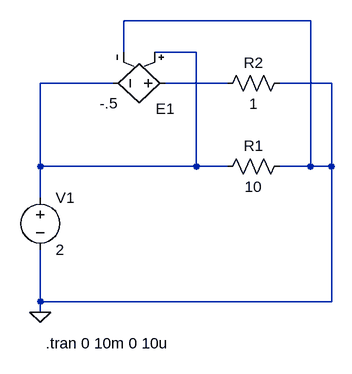
[diagram p0: schematic vcvs_2.asc]
vcvs_2.asc, the LTspice schematic file:
Version 4.1
SHEET 1 880 680
WIRE 368 -96 80 -96
WIRE 80 -48 80 -96
WIRE 192 -48 128 -48
WIRE 64 0 -48 0
WIRE 240 0 144 0
WIRE 400 0 320 0
WIRE -48 128 -48 0
WIRE 192 128 192 -48
WIRE 192 128 -48 128
WIRE 240 128 192 128
WIRE 368 128 368 -96
WIRE 368 128 320 128
WIRE 400 128 400 0
WIRE 400 128 368 128
WIRE -48 176 -48 128
WIRE -48 336 -48 256
WIRE 400 336 400 128
WIRE 400 336 -48 336
WIRE -48 352 -48 336
FLAG -48 352 0
SYMBOL voltage -48 160 R0
WINDOW 123 0 0 Left 0
WINDOW 39 0 0 Left 0
SYMATTR InstName V1
SYMATTR Value 2
SYMBOL res 336 112 R90
WINDOW 0 0 56 VBottom 2
WINDOW 3 32 56 VTop 2
SYMATTR InstName R1
SYMATTR Value 10
SYMBOL e 160 0 R90
WINDOW 0 39 1 VRight 2
WINDOW 3 31 88 VRight 2
SYMATTR InstName E1
SYMATTR Value -.5
SYMBOL res 336 -16 R90
WINDOW 0 0 56 VBottom 2
WINDOW 3 32 56 VTop 2
SYMATTR InstName R2
SYMATTR Value 1
TEXT -40 400 Left 2 !.tran 0 10m 0 10u

The netlist it stands for:
* vcvs_2.asc
V1 N001 0 2
R1 0 N001 10
E1 N002 N001 N001 0 -.5
R2 0 N002 1
.tran 0 10m 0 10u
.backanno
.end